# Altium schematic sheet Esquematico.SchDoc
size A4; SheetNumber: 1; SheetTotal: 1
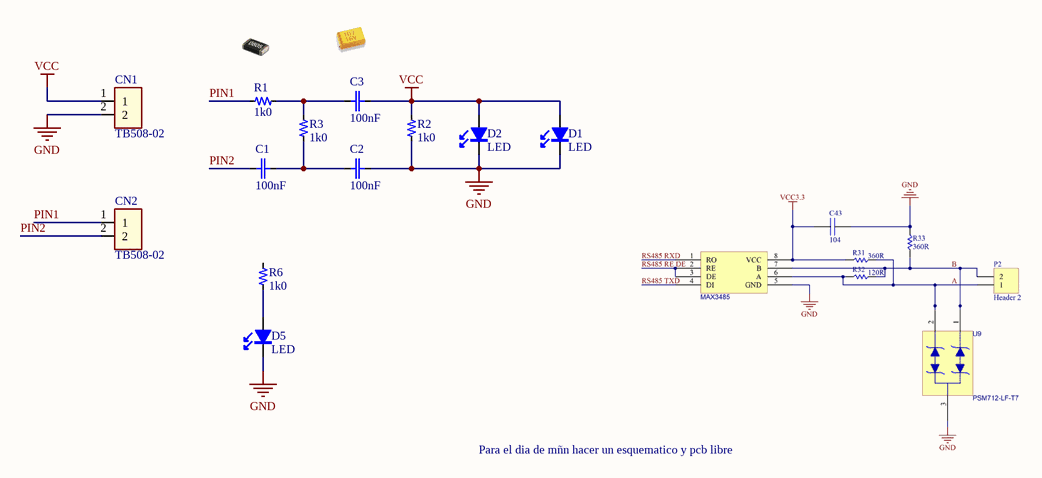
[diagram p0: Esquematico.SchDoc]

## Parts
C1  100nF  [C0805]
C2  100nF  [C0805]
C3  100nF  [C0805]
CN1  TB508-02  [TB508-02]
CN2  TB508-02  [TB508-02]
D1  LED  [LED-0805]
D2  LED  [LED-0805]
D5  LED  [LED-1210]
R1  1k0  [R2512]
R2  1k0  [R2512]
R3  1k0  [R2512]
R6  1k0  [R2512]

## Nets
GND: C2.1 CN1.2 D1.1 D2.1 D5.1 R2.1
VCC: C3.1 CN1.1 D1.2 D2.2 R2.2
PIN1: CN2.1 R1.1
PIN2: C1.2 CN2.2
NetC1_1: C1.1 C2.2 R3.1
NetC3_2: C3.2 R1.2 R3.2
NetD5_2: D5.2 R6.1

Not connected (* = marked no-connect by the designer): R6 2

## Notes on the sheet
- Para el dia de mñn hacer un esquematico y pcb libre

## Library data of the parts
C1-C3 = Capacitor: Capacitor without polarity; Voltage: 25V; Part number: *; Manufacturer: *; Unit price: *; Value: 100nF
CN1 CN2 = TB-02: Terminal Block; Manufacturer: *; Part number: *; Unit price: *; Value: TB508-02
D1 D2 D5 = LED: LED - Light-Emitting Diode; Manufacturer: *; Part number: *; Unit price: *; Value: LED
R1-R3 R6 = Resistor: Single resistor; Power: 0.125W; Manufacturer: *; Part number: *; Value: 1k0; Unit price: 0.1